# Altium schematic sheet Gochermann_Solar_PanelRev3.5.SchDoc
size A4; SheetNumber: 1; SheetTotal: 1
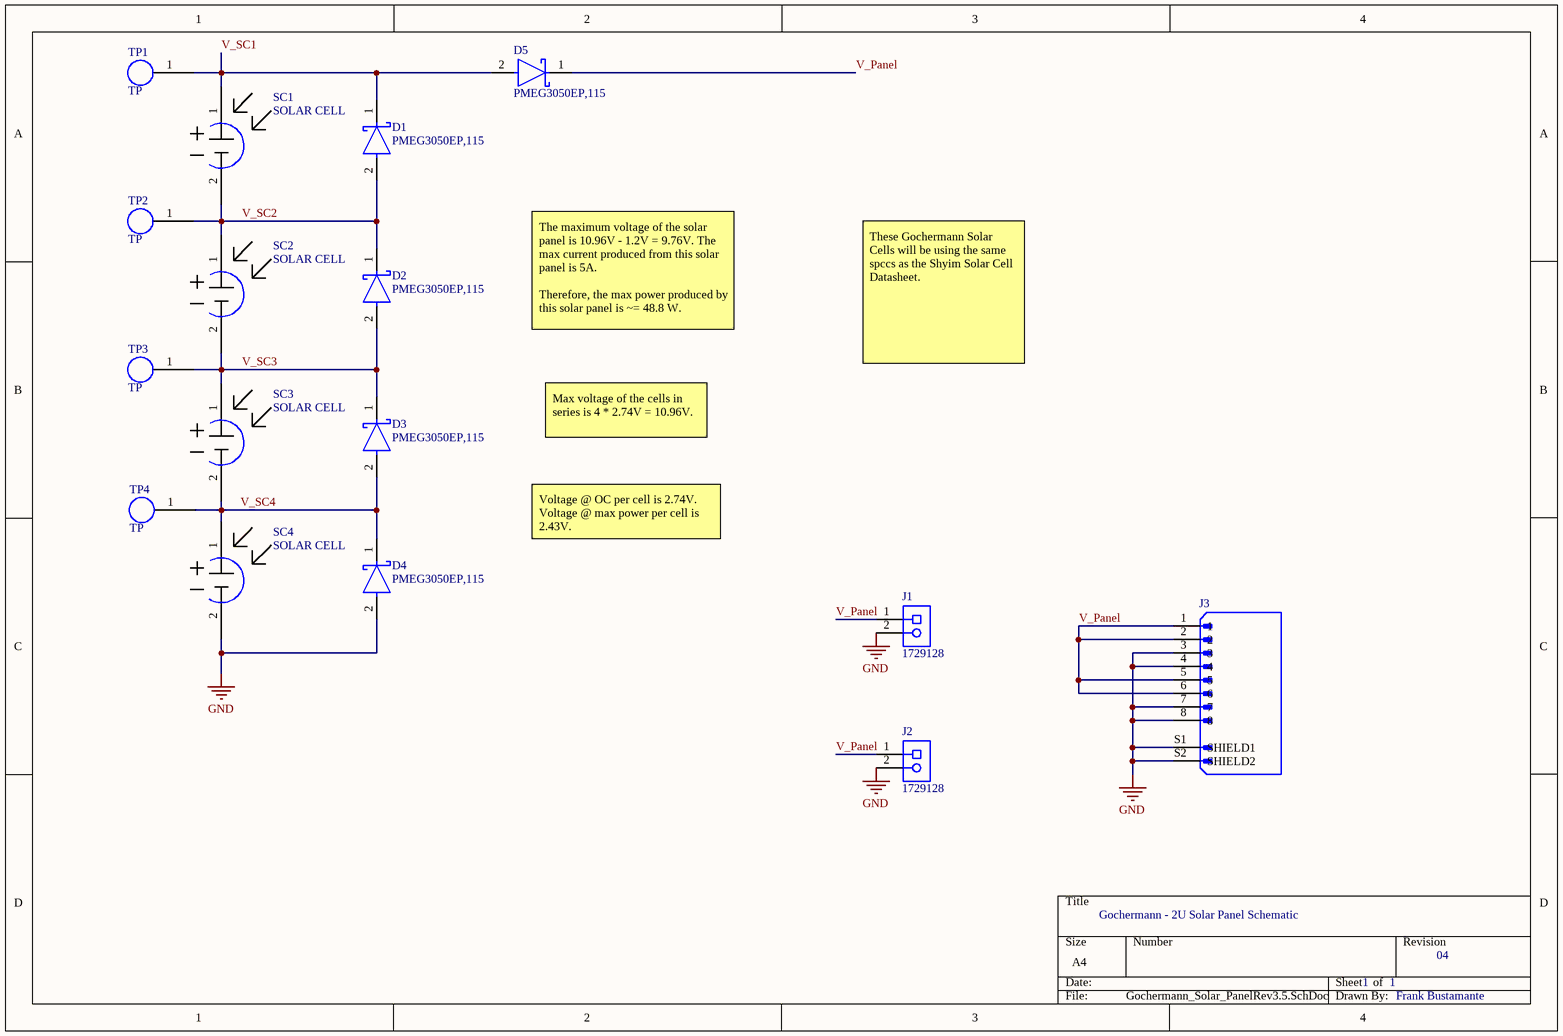
[diagram p0: Gochermann_Solar_PanelRev3.5.SchDoc]

## Parts
D1  PMEG3050EP,115  [FP-SOD128-MFG]
D2  PMEG3050EP,115  [FP-SOD128-MFG]
D3  PMEG3050EP,115  [FP-SOD128-MFG]
D4  PMEG3050EP,115  [FP-SOD128-MFG]
D5  PMEG3050EP,115  [FP-SOD128-MFG]
J1  1729128  [PHOE-1729128-2_V]
J2  1729128  [PHOE-1729128-2_V]
J3  (no value)  [MOLEX_5040500891]
SC1  SOLAR CELL  [SOL_CEL_GOCHERMANN]
SC2  SOLAR CELL  [SOL_CEL_GOCHERMANN]
SC3  SOLAR CELL  [SOL_CEL_GOCHERMANN]
SC4  SOLAR CELL  [SOL_CEL_GOCHERMANN]
TP1  TP  [TP]
TP2  TP  [TP]
TP3  TP  [TP]
TP4  TP  [TP]

## Nets
GND: D4.2(A) J1.2 J2.2 J3.3 J3.4 J3.7 J3.8 J3.S1(SHIELD1) J3.S2(SHIELD2) SC4.2
V_Panel: D5.1(C) J1.1 J2.1 J3.1 J3.2 J3.5 J3.6
V_SC1: D1.1(C) D5.2(A) SC1.1 TP1.1
V_SC2: D1.2(A) D2.1(C) SC1.2 SC2.1 TP2.1
V_SC3: D2.2(A) D3.1(C) SC2.2 SC3.1 TP3.1
V_SC4: D3.2(A) D4.1(C) SC3.2 SC4.1 TP4.1

## Notes on the sheet
- The maximum voltage of the solar panel is 10.96V - 1.2V = 9.76V. The max current produced from this solar panel is 5A.
  Therefore, the max power produced by this solar panel is ~= 48.8 W.
- These Gochermann Solar Cells will be using the same spccs as the Shyim Solar Cell Datasheet.
- Max voltage of the cells in series is 4 * 2.74V = 10.96V.
- Voltage @ OC per cell is 2.74V.                                                                  Voltage @ max power per cell is 2.43V.
- Gochermann - 2U Solar Panel Schematic
- 1
- 04
- Frank Bustamante

## Library data of the parts
D1-D5 = CMP-14398-000051-1: DIODE SCHOTTKY 30V 5A SOD128; RoHS Compliant: Yes
J1 J2 = CMP-2000-05815-1: PCB Terminal Block, 13.5 A, 400 V, 2-Pin THD, RoHS, Bulk; Manufacturer: Phoenix Contact; Package Version: 03/2015; No. of Rows: 1; Pitch: 5.08mm; No. of Positions: 2; Voltage Rating: 400V; Current Rating: 13500mA; Fastening Method: SCREW; Wire/Cable Gauge: 16AWG; Wire Cross Section: 1.5mm2; Safety Approval: CSA,CUL,CB,EAC; Manufacturer URL: http://www.phoenixcontact.com/; Datasheet URL: https://datasheet.ciiva.com/16046/1729128-16046181.pdf; RoHS: TRUE; Package URL: https://www.phoenixcontact.com/online/portal/pi/pxc/product_detail_page/!ut/p/b1/3VdJjqNKFDxLH8AFycySyWY2ozFsEPOMMQaDOX1XedGL_1Vdm5YXJleknhSKeBkvI6EA8ncAo3AYoDhBQGco6KN7VURTdemj9us_IEKEZo_YHiPAEWEFmDGOHMORkqKYCORBZxgL7ZoaZYcbFFUZ3fqxSY6GOuxydWUuHqz1ynmMFygu583Bob0Ewr6Sd_l-5m-kAueHiB0jpRwZwe58wwtkpxtMYd_LmGcDRU02dRNEyWt6Y2ti5pSyJ_reIkzIulrqApdnbT11V5jnCKbYNCvhEM1MCpPByat_X379-iThf08CI5GfOPqfBeS3BRoBOdD55AKVv0iLwCMq-2BrzXWSGRH7pUGD9uwXQjiph3xL0DKQwdGa0JImiIOmBNOestqgwTHSSs2oOep-78apyXQBvNi8ZLaFjvjWvcaUEBu0MC6Wbe-d6mB0FAebo2lUWinqYaZs5DAYzV0RP9yitUjnGJ0iI9xhZkT42OCQNUJJhkgWINNQLP2JFP6OpMg3JCVg70jqHT0lvKOnhHf0lPuOnnLf0VPuWx6_dxwUIvwk5WMkT0kLL1mh61l2yZVSzG3pYV_bqo-mj6uMKwKwdnnW8Jh5RTOJzMOA5c-eJDaZQw4mTMPH02PvS_ZAqNVjVTo2WyYLkwH_KU1mmmG5kjRhDqPXLwwVHvVOjCM60-fpXvTDfMGW1PVFVS1r4e4yVDk4ZdNbkUHvqPqQSeian4UD39fNKmachqdJ1NJbyk8rXT9mXTvPk3oE5meulKGgiruPJek-4I9hTT6G8ZLOyRSm2RRVbThERQad5OS28hdt4YW4vG0stgYYzsWsK4_7y6DZMjJSCqri1kyiZR5vD7pwIrNR7QwPHTcLTI5qT7eRlpHrdGiupYlqQDJ7zy_CND8fWWBoLRXxk1RVcXiBQwbTD4Xi7KL-FuO94t9xaqweXzH; PartNumber: 1729128; Package Description: 2-Pin Through Hole Device, Body 8.1 x 10.16 mm, Pitch 5.08 mm; Datasheet Version: 12/2013; Mounting Technology: ThroughHole; Orientation: Horizontal; Package Reference: 1729128-2; Packing: Bulk; Supplier 1: Arrow Electronics; Manufacturer Part Number: 1729128; Category: Terminal Blocks; Stock 1: 1412; Pricing 1: 1=1.1123, 10=1.066, 50=1.0202, 100=0.993, 250=0.929, 500=0.8556, 1000=0.7754, 2500=0.7296 (USD); Terminal and Terminal Block Type: BARRIER STRIP TERMINAL BLOCK; Number of Decks: 1; Number of Rows: 1; Number of Ways: 2; RoHS Compliant: Yes; Reach SVHC Compliant: No; ComponentLink1URL: https://datasheet.ciiva.com:443/pdfs/VipMasterIC/IC/PCON/PCON-S-A0008047989/PCON-S-A0008036843-1.pdf?src-supplier=IHS+Markit; ComponentLink1Description: https://datasheet.ciiva.com:443/pdfs/VipMasterIC/IC/PCON/PCON-S-A0008047989/PCON-S-A0008036843-1.pdf?src-supplier=IHS+Markit; ComponentLink2URL: https://datasheet.ciiva.com/16046/1729128-16046181.pdf?src-supplier=Onlinecomponents.com; ComponentLink2Description: https://datasheet.ciiva.com/16046/1729128-16046181.pdf?src-supplier=Onlinecomponents.com; ComponentLink3URL: https://datasheet.ciiva.com/15169/getdatasheetpartid-199310-15169845.pdf?src-supplier=Verical; ComponentLink3Description: https://datasheet.ciiva.com/15169/getdatasheetpartid-199310-15169845.pdf?src-supplier=Verical; ComponentLink4URL: https://datasheet.ciiva.com/823/1729128-823779.pdf?src-supplier=Digi-Key; ComponentLink4Description: https://datasheet.ciiva.com/823/1729128-823779.pdf?src-supplier=Digi-Key; ComponentLink5URL: https://datasheet.ciiva.com/14607/70054405-14607157.pdf?src-supplier=Allied+Electronics; ComponentLink5Description: https://datasheet.ciiva.com/14607/70054405-14607157.pdf?src-supplier=Allied+Electronics; ComponentLink6URL: https://datasheet.ciiva.com/29218/743664-da-01-en-printklemmenblock-mkdsn-1-5-2-5-08-29218154.pdf?src-supplier=Conrad; ComponentLink6Description: https://datasheet.ciiva.com/29218/743664-da-01-en-printklemmenblock-mkdsn-1-5-2-5-08-29218154.pdf?src-supplier=Conrad
J3 = EPS_5040500891_Molex_Connector
SC1-SC4 = SOL_CEL_Gochermann: Solar Cell from Gochermann; InternalPart#: SC-3GA-3